# EAGLE design holo clock 1 (EAGLE 6.2)
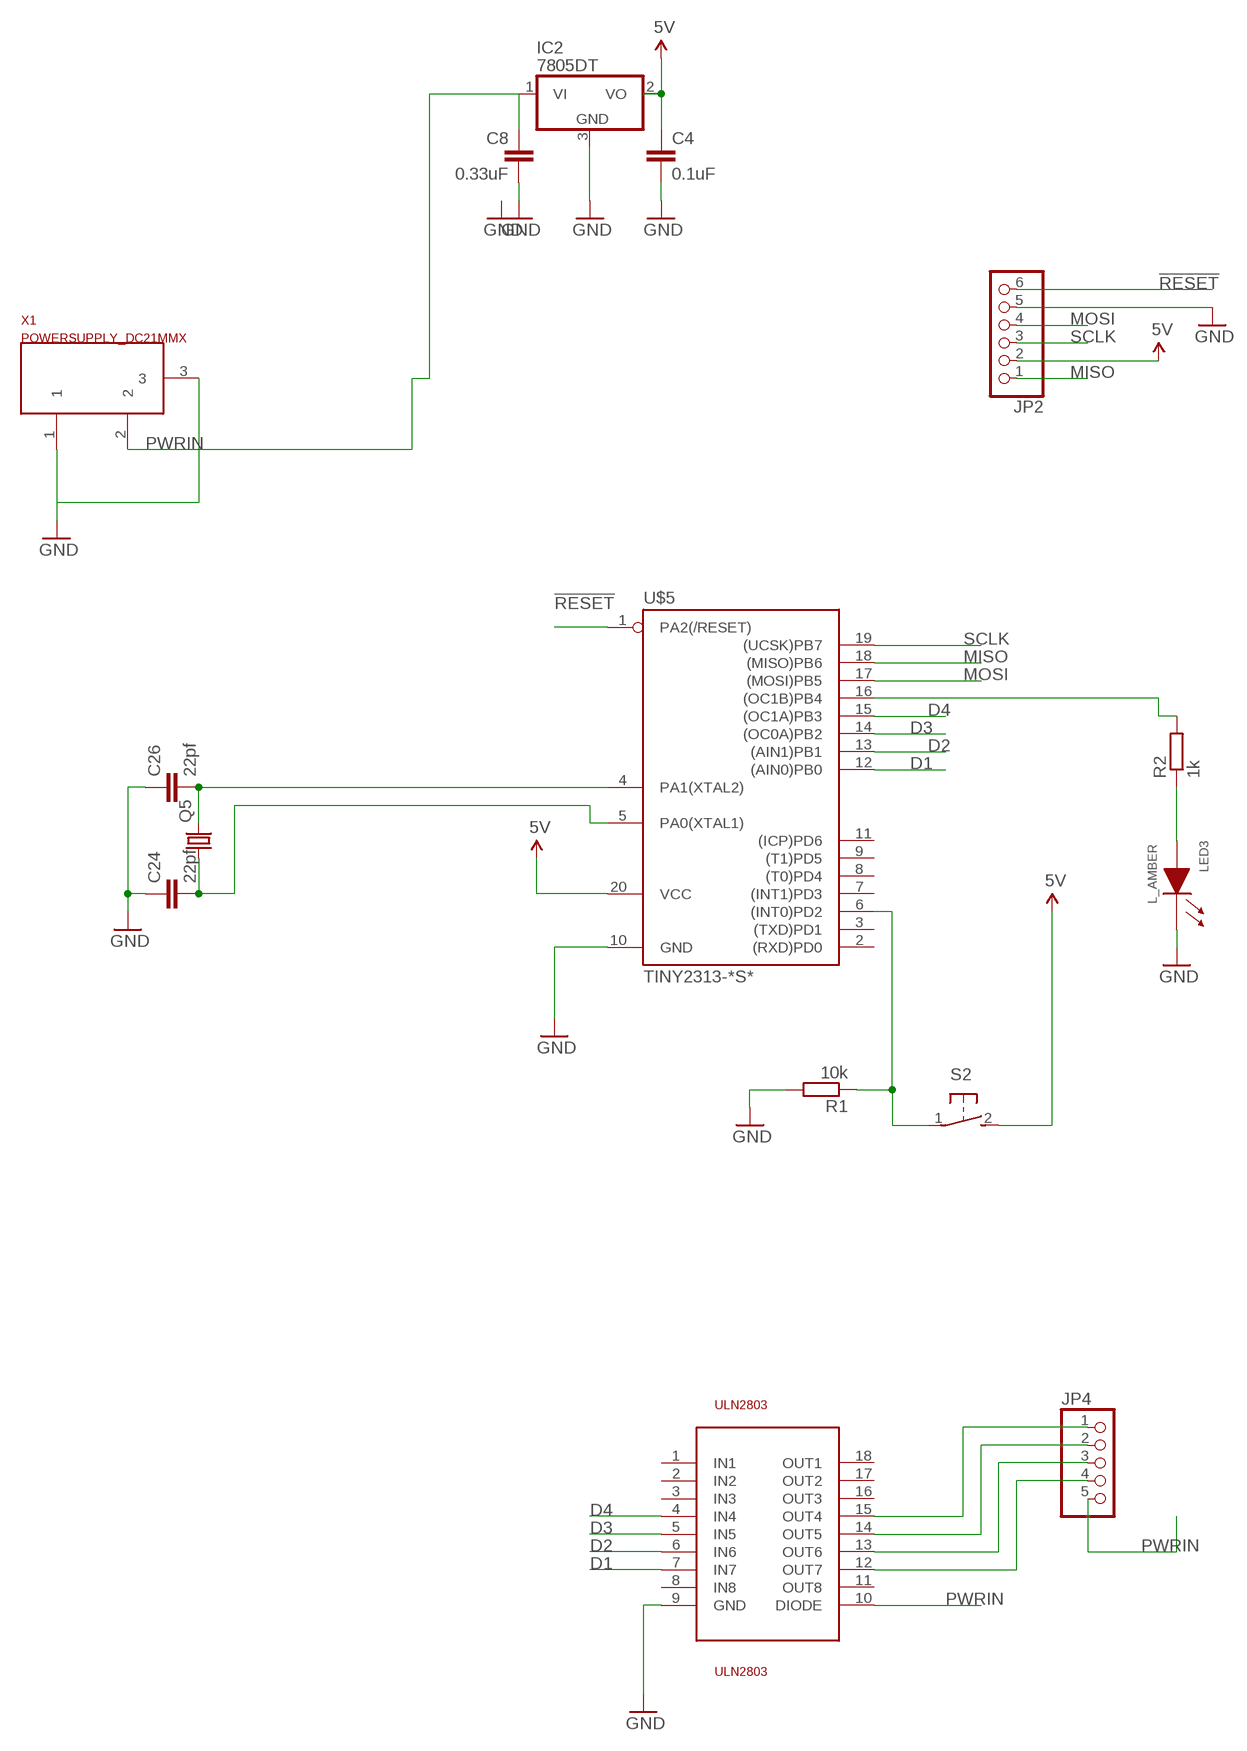
[diagram p0: schematic, sheet 1]

## Parts
C4  0.1uF  CAPPTH2  [CAP-PTH-SMALL2]
C8  0.33uF  CAPPTH2  [CAP-PTH-SMALL2]
C24  22pf  CAP0805  [0805]
C26  22pf  CAP0805  [0805]
IC2  7805DT  [TO252]
JP2  PINHD-1X6  [1X06]
JP4  PINHD-1X5  [1X05]
LED3  L_AMBER  LED0805  [LED0805]
Q5  CRYSTALHC49S  [HC49/S]
R1  10k  R-EU_R0805  [R0805]
R2  1k  R-EU_R0805  [R0805]
S2  31-XX  [B3F-31XX]
U$5  TINY2313-*S*  [SO20L$]
ULN2803  ULN2803  [SO18L]
X1  POWERSUPPLY_DC21MMX  [POWERSUPPLY_DC-21MM]

## Nets
5V: C4.1 IC2.2(VO) JP2.2 S2.2(S) U$5.20(VCC)
!RESET: JP2.6 U$5.1(PA2(/RESET))
D1: U$5.12((AIN0)PB0) ULN2803.7(IN7)
D2: U$5.13((AIN1)PB1) ULN2803.6(IN6)
D3: U$5.14((OC0A)PB2) ULN2803.5(IN5)
D4: U$5.15((OC1A)PB3) ULN2803.4(IN4)
GND: C4.2 C8.2 C24.1 C26.1 IC2.3(GND) JP2.5 LED3.1(CA) R1.2 U$5.10(GND) ULN2803.9(GND) X1.1 X1.3
MISO: JP2.1 U$5.18((MISO)PB6)
MOSI: JP2.4 U$5.17((MOSI)PB5)
N$1: JP4.1 ULN2803.15(OUT4)
N$2: R2.2 U$5.16((OC1B)PB4)
N$3: JP4.2 ULN2803.14(OUT5)
N$4: JP4.3 ULN2803.13(OUT6)
N$5: JP4.4 ULN2803.12(OUT7)
N$7: LED3.2(AN) R2.1
N$8: R1.1 S2.1(P) U$5.6((INT0)PD2)
N$80: C26.2 Q5.2 U$5.4(PA1(XTAL2))
N$81: C24.2 Q5.1 U$5.5(PA0(XTAL1))
PWRIN [power]: C8.1 IC2.1(VI) JP4.5 ULN2803.10(DIODE) X1.2
SCLK: JP2.3 U$5.19((UCSK)PB7)
Unconnected: U$5.2((RXD)PD0) U$5.3((TXD)PD1) U$5.7((INT1)PD3) U$5.8((T0)PD4) U$5.9((T1)PD5) U$5.11((ICP)PD6) ULN2803.1(IN1) ULN2803.2(IN2) ULN2803.3(IN3) ULN2803.8(IN8) ULN2803.11(OUT8) ULN2803.16(OUT3) ULN2803.17(OUT2) ULN2803.18(OUT1)

## Library data of the parts
C4 C8 C24 C26 = SparkFun:CAP: Capacitor Standard 0603 ceramic capacitor, and 0.1" leaded capacitor.
IC2 = linear:78*: Positive VOLTAGE REGULATOR Source: http://cache.national.com/ds/LM/LM78L05.pdf http://www.fairchildsemi.com/ds/LM/LM7805.pdf
JP2 = pinhead:PINHD-1X6: PIN HEADER
JP4 = pinhead:PINHD-1X5: PIN HEADER
LED3 = MySMD:LED0805
Q5 = crystal:CRYSTAL: CRYSTAL; OC_FARNELL: 1667008; OC_NEWARK: unknown
R1 R2 = resistor:R-EU_: RESISTOR, European symbol
S2 = switch-omron:31-XX: OMRON SWITCH; MPN: B3F-3100; OC_FARNELL: 959704; OC_NEWARK: 36M3582
U$5 = avr-7:TINY2313*: Atmel Tiny2313 2K Flash, 128 bytes EEPROM, 128 bytes RAM
ULN2803 = uln2803:ULN2803
X1 = SmartPrj:POWERSUPPLY_DC21MM

## Net classes
0 default: width 0.178 mm, drill 0.406 mm, clearance 0.178 mm

## Board
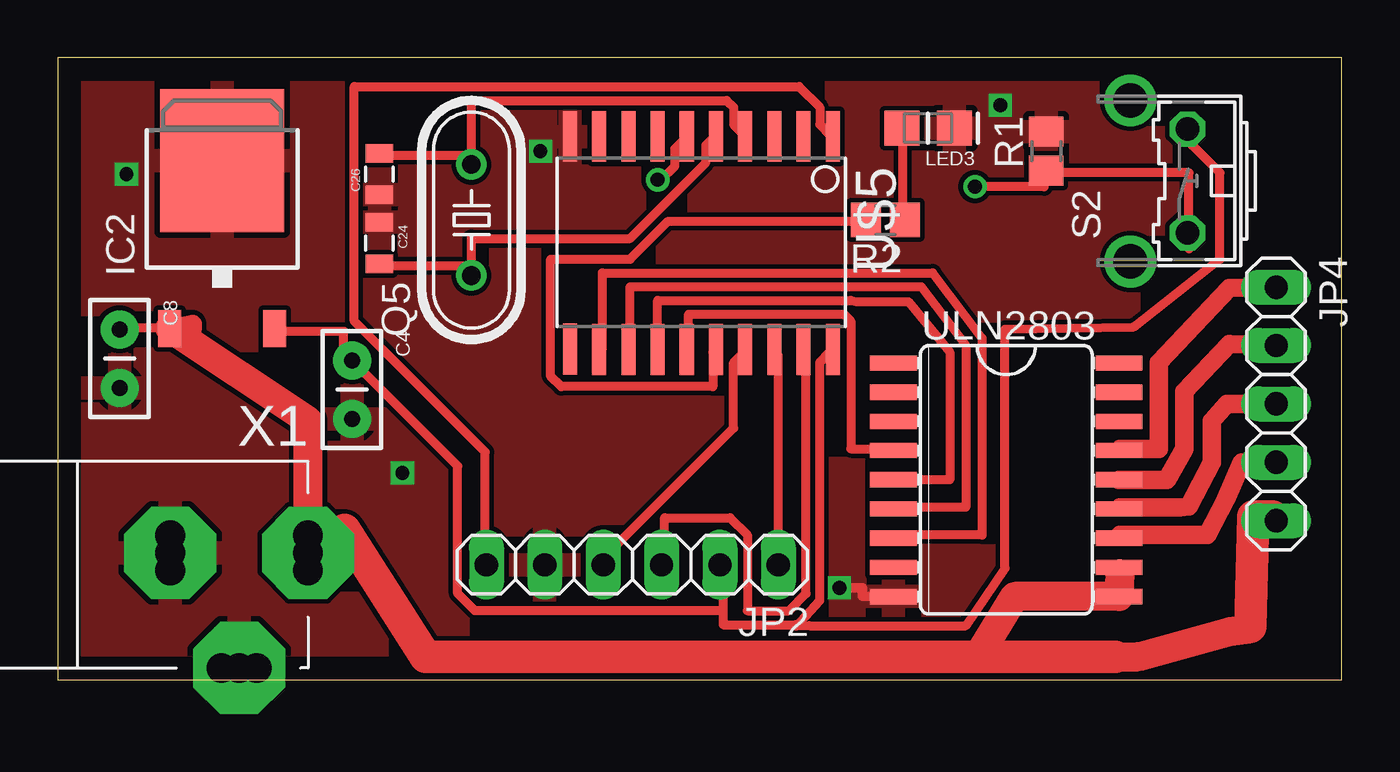
[diagram p1: board, top side]
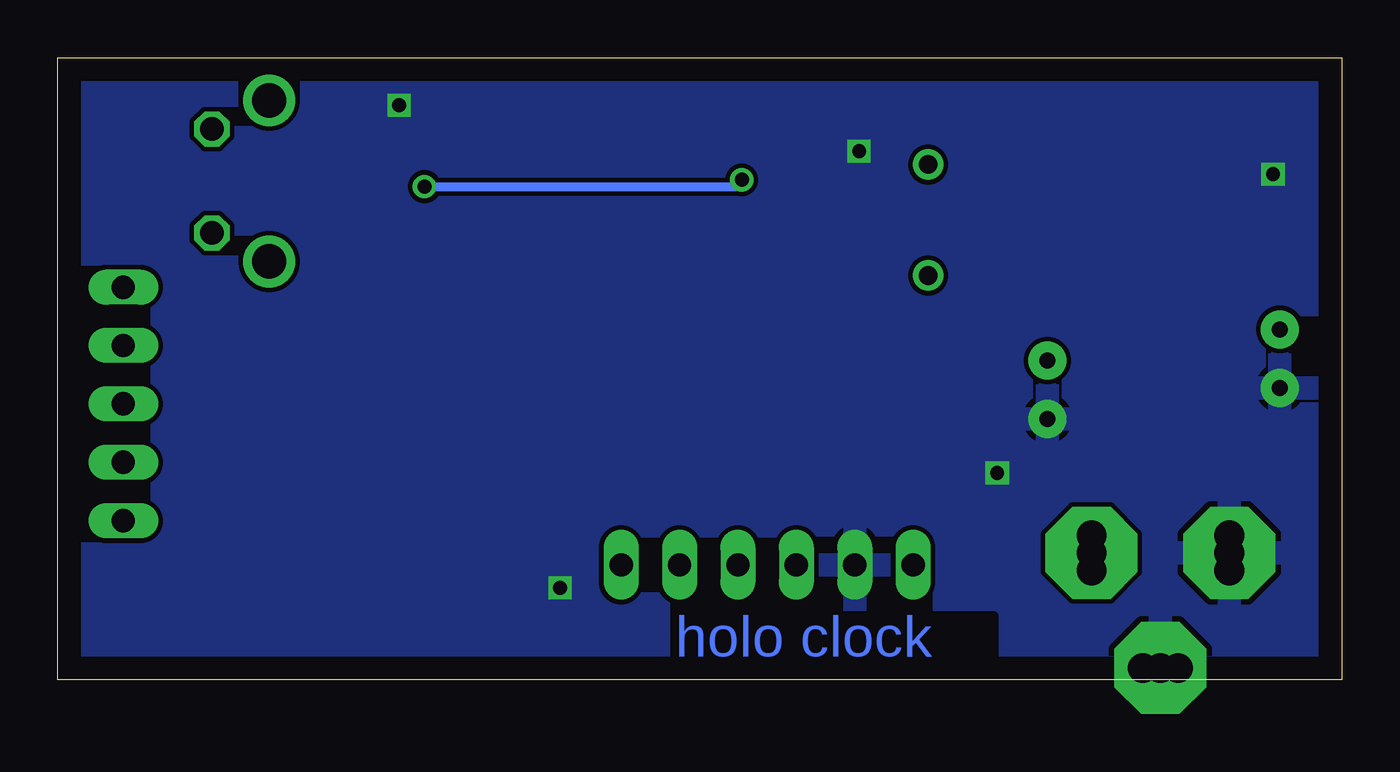
[diagram p2: board, bottom side, seen from below]

Size 55.86 x 27.07 mm. Coordinates in mm from the lower left corner, seen from the top.
Outline: 0,0 55.86,0 55.86,27.07 0,27.07 0,0
Copper layers (1*16): Top 0.035mm / dielectric 1.5mm / Bottom 0.035mm
Design rules: minimum track width 15mil, minimum drill 24mil, track to track 8mil, track to pad 8mil, pad to pad 8mil, via to via 8mil, smd to smd 8mil, copper to edge 40mil, drill to drill 8mil, minimum pad ring 10mil, minimum via ring 8mil, stop-mask expansion 4mil, vias tented up to drill 0mil, thermal gap 10mil

### Footprints (pad centres in the part's own frame; a part is rotated, then mirrored left to right if it is on the bottom)
CAP-PTH-SMALL2 = drill 0.7 pad 1.651: 1 0,0; 2 2.54,0
0805 = smd 0.8 x 1.2: 1 -0.9,0; 2 0.9,0
TO252 = smd 1 x 1.6: 1 -2.28,-4.8; 2 2.28,-4.8 | smd 5.4 x 6.2: 3 0,2.5
1X06 = drill 1.016 long: 1 -6.35,0; 2 -3.81,0; 3 -1.27,0; 4 1.27,0; 5 3.81,0; 6 6.35,0
1X05 = drill 1.016 long: 1 -5.08,0; 2 -2.54,0; 3 0,0; 4 2.54,0; 5 5.08,0
LED0805 = smd 1.524 x 1.524: 1 0,0; 2 2.286,0
HC49/S = drill 0.813: 1 -2.413,0; 2 2.413,0
R0805 = smd 1.3 x 1.5: 1 -0.85,0; 2 0.85,0
B3F-31XX = drill 1.016 octagon: 1 -2.261,-1.245; 2 2.261,-1.245 | drill 1.499 pad 2.159: 3 -3.505,1.245; 4 3.505,1.245
SO20L$ = smd 0.61 x 2.21: 1 -5.715,-4.636; 2 -4.445,-4.636; 3 -3.175,-4.636; 4 -1.905,-4.636; 5 -0.635,-4.636; 6 0.635,-4.636; 7 1.905,-4.636; 8 3.175,-4.636; 9 4.445,-4.636; 10 5.715,-4.636; 11 5.715,4.61; 12 4.445,4.636; 13 3.175,4.636; 14 1.905,4.636; 15 0.635,4.636; 16 -0.635,4.636; 17 -1.905,4.636; 18 -3.175,4.636; 19 -4.445,4.636; 20 -5.715,4.636
SO18L = smd 0.66 x 2.032: 1 -5.08,-4.902; 2 -3.81,-4.902; 3 -2.54,-4.902; 4 -1.27,-4.902; 5 0,-4.902; 6 1.27,-4.902; 7 2.54,-4.902; 8 3.81,-4.902; 9 5.08,-4.902; 10 5.08,4.902; 11 3.81,4.902; 12 2.54,4.902; 13 1.27,4.902; 14 0,4.902; 15 -1.27,4.902; 16 -2.54,4.902; 17 -3.81,4.902; 18 -5.08,4.902
POWERSUPPLY_DC-21MM = drill 1.3 pad 4 octagon: 1 -5.08,-3.353; 2 -0.076,-6.35; 3 -0.076,-0.356 | drill 1.3: 4 -5.08,-4.115; 5 -5.08,-2.591; 6 -0.838,-0.356; 7 0.686,-0.356; 8 -0.838,-6.35; 9 0.686,-6.35

### Placement (x,y rotation side)
C4  12.81,13.89 270 top
C8  2.7,15.24 270 top
C24  14,19 270 top
C26  14,22 90 top
IC2  7.16,20.08 0 top
JP2  25,5 180 top
JP4  53,12 270 top
LED3  39,24 180 top
Q5  18,20 90 top
R1  43,23 90 top
R2  36,20 180 top
S2  47.9,21.7 90 top
U$5  28,19 180 top
ULN2803  41.26,8.7 270 top
X1  4.54,5.59 90 top

### Tracks (layer width: path | path; a pad name or v marks a point on that pad's centre or on a via)
5V
  Top 0.381: IC2.2 9.45,15.15 12.45,15.15 12.45,14.25 C4.1 17.4,9.3 17.4,3.75 18.15,3 28.95,3 | 32.12,2.33 32.1,2.4 28.95,2.4 28.95,3 | 32.12,2.33 33.15,3.45 33.15,13.8 33.6,14.25 U$5.20 | 28.95,3 28.95,4.95 JP2.2 | S2.2 49.35,23.25 50.55,22.05 50.55,18.3 46.8,15.35 41.2,15.25 41.2,4.85 39.5,2.35 32.7,2.35 32.12,2.33
!RESET
  Top 0.381: U$5.1 33.6,23.7 33.15,24.15 33.15,24.9 32.25,25.8 12.9,25.8 12.9,15.6 18.6,9.9 18.6,5.1 JP2.6
D1
  Top 0.381: ULN2803.7 36.45,6.3 40.2,6.3 40.2,14.85 38.05,17.7 23.7,17.7 23.7,14.4 U$5.12
D2
  Top 0.381: ULN2803.6 36.45,7.5 39.5,7.5 39.5,14.55 37.55,17.1 24.9,17.1 24.9,14.4 U$5.13
D3
  Top 0.381: ULN2803.5 38.8,8.7 38.8,14.25 37,16.45 34.75,16.45 34.5,16.5 26.1,16.5 26.1,14.4 U$5.14
D4
  Top 0.381: ULN2803.4 36.3,10.05 34.5,10.05 34.5,15.6 34.2,15.9 27.45,15.9 27.45,14.4 U$5.15
GND  (via drill 0.6)
  Top 0.381: C26.1 14.1,21.15 C26.1 | C26.1 13.95,21.15 C26.1
  Top 0.406: ULN2803.9 35,3.62 35,4 v34,4
  other vias: 41,25 15,9 21,23 3,22
  pour Bottom: 0,26 56,26 56,0 0,0
  pour Top: 0,26 56,26 56,0 0,0
MISO
  Top 0.381: JP2.1 31.35,14.1 31.2,14.25 U$5.18
MOSI
  Top 0.381: U$5.17 29.85,14.25 29.4,13.8 29.4,10.95 23.85,5.4 23.85,5.1 JP2.4
N$1
  Top 0.381: 46.2,10.05 ULN2803.15
  Top 0.813: 46.2,10.05 47.9,10.05 47.9,13.8 50.95,17.05 JP4.1
N$2
  Top 0.381: R2.2 35.1,19.95 26.55,19.95 24.9,18.3 21.45,18.3 21.45,13.2 21.9,12.75 28.5,12.75 28.5,14.25 U$5.16
N$3
  Top 0.813: ULN2803.14 48.25,8.7 49,10.05 49,12.55 50.95,14.6 JP4.2
N$4
  Top 0.381: 46.2,7.5 ULN2803.13
  Top 0.813: 46.2,7.5 48.8,7.5 49.2,7.55 50.2,9.45 50.2,11.25 50.85,12 JP4.3
N$5
  Top 0.381: 46.2,6.3 ULN2803.12 | 52.95,9.45 JP4.4
  Top 0.813: 46.2,6.3 50,6.3 50.8,7.85 51.5,9.45 52.95,9.45
N$7
  Top 0.381: 36.75,24 LED3.2 36.75,23.85 36.75,20.1 R2.1
N$8  (via drill 0.61)
  Top 0.381: S2.1 49.2,18.75 49.2,22.05 43.05,22.05 R1.1 42.9,22.05 42.9,21.45 v39.9,21.45 | v26.1,21.75 26.25,21.75 26.85,22.35 26.85,23.1 27.3,23.55 U$5.6
  Bottom 0.381: v26.1,21.75 26.4,21.45 v39.9,21.45
N$80
  Top 0.381: C26.2 14.1,22.8 18,22.8 Q5.2 18,25.2 29.1,25.2 29.4,24.9 29.4,24.15 29.85,23.7 U$5.4
N$81
  Top 0.381: C24.2 14.1,18 18,18 Q5.1 18,19.2 24.9,19.2 28.2,22.5 28.2,23.25 28.5,23.55 U$5.5
PWRIN
  Top 0.381: 5.84,15.24 5.84,14.48 | 52.83,7.11 JP4.5 | C8.1 2.7,15.3 4.35,15.3 IC2.1
  Top 0.813: 5.84,14.48 5.87,15.48 IC2.1
  Top 1.27: X1.2 10.89,11.27 IC2.1 | 46,1 47,1 51,2.1 51.8,2.21 52,7.11 | 46.2,4.62 ULN2803.10 41.62,3.62 40,1
  Top 1.422: 52.83,7.11 52,7.11 51.86,2.31 | X1.2 12.49,6.51 16,1 40,1 46,1
SCLK
  Top 0.381: U$5.19 32.55,14.25 32.55,3.75 31.8,3 30,3 30,6.3 29.25,7.05 26.4,7.05 26.4,5.1 JP2.3

### Text on the board
Bottom: holo clock